# Altium schematic sheet VOEDING.SchDoc
size A3; SheetNumber: 5; SheetTotal: 7
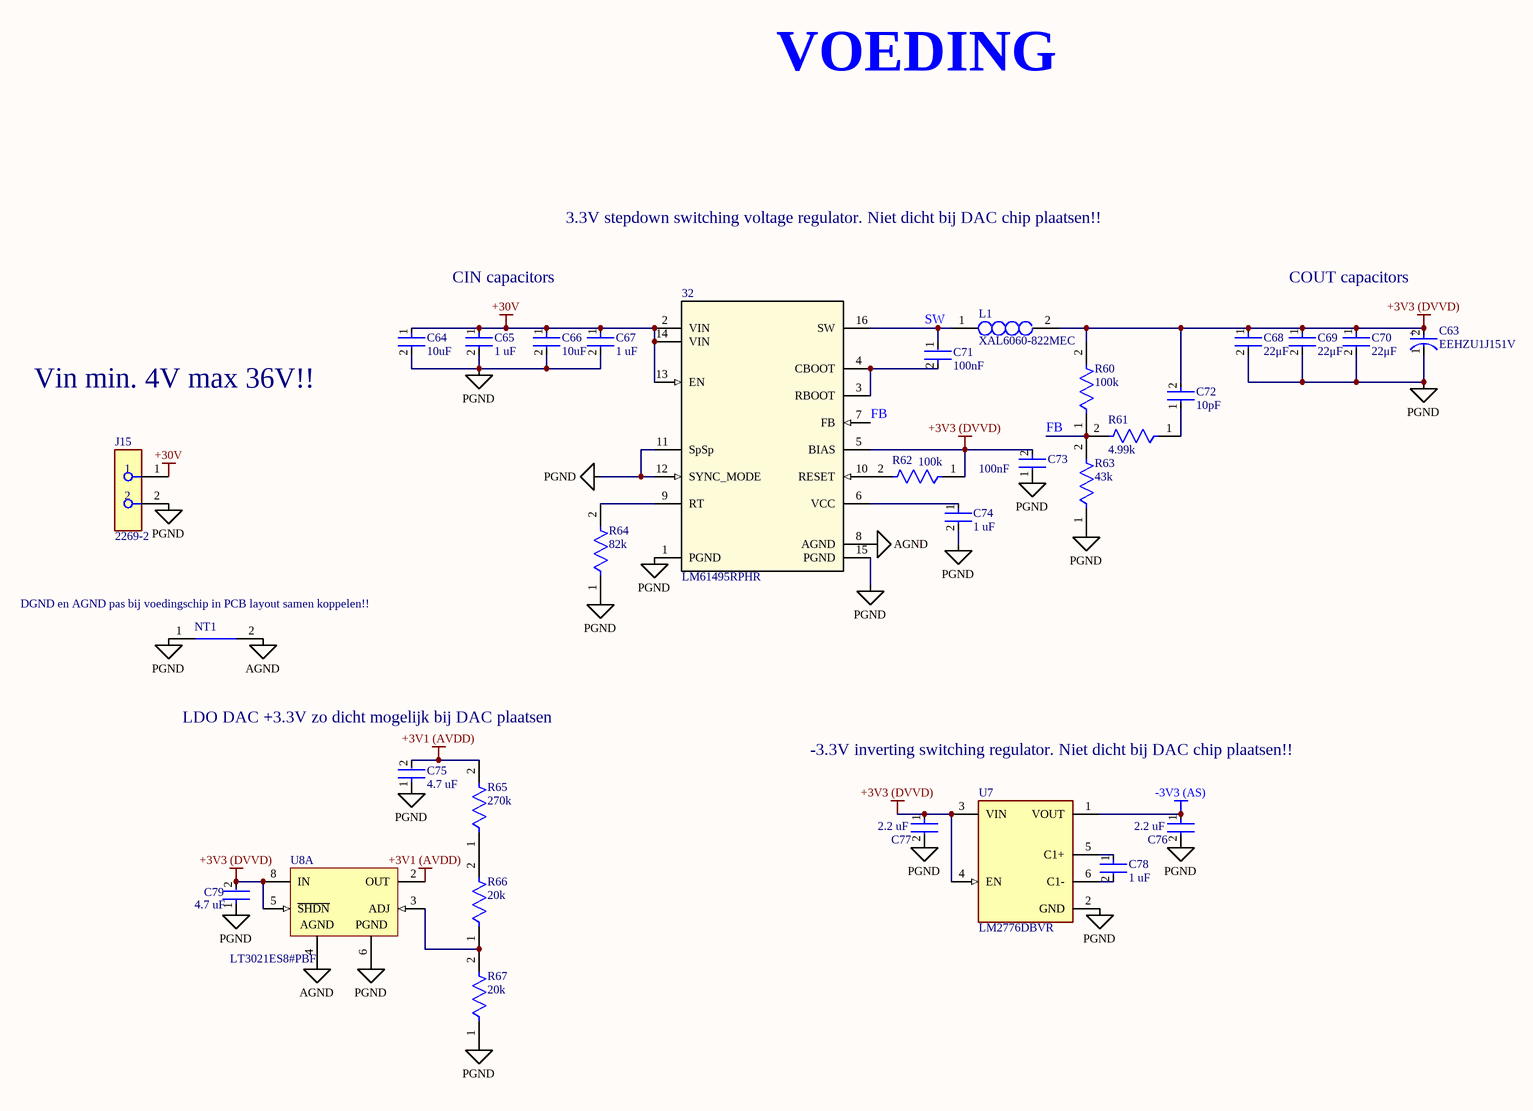
[diagram p0: VOEDING.SchDoc]

## Parts
32  LM61495RPHR  [RPH0016A]
C63  EEHZU1J151V  [FP-EEH-G16-V-MFG]
C64  10uF  [FP-GRM32-MFG]
C65  1 uF  [FP-C0603C-CF-MFG]
C66  10uF  [FP-GRM32-MFG]
C67  1 uF  [FP-C0603C-CF-MFG]
C68  22μF  [FP-C2012-125-0_2-MFG]
C69  22μF  [FP-C2012-125-0_2-MFG]
C70  22μF  [FP-C2012-125-0_2-MFG]
C71  100nF  [FP-GRM15-MFG]
C72  10pF  [FP-GRM15-MFG]
C73  100nF  [FP-GRM15-MFG]
C74  1 uF  [FP-C0603C-CF-MFG]
C75  4.7 uF  [FP-C0603C-CF-MFG]
C76  2.2 uF  [FP-C0603C-CF-MFG]
C77  2.2 uF  [FP-C0603C-CF-MFG]
C78  1 uF  [FP-C0603C-CF-MFG]
C79  4.7 uF  [FP-C0603C-CF-MFG]
J15  2269-2  [FP-2269-2-MFG]
L1  XAL6060-822MEC  [XAL6060822MEC]
NT1  NT (AGND en PGND)  [NET_TIE_SMD_]  (value not drawn)  (net tie, no BOM)
R60  100k  [FP-CRCW0402-C-e3-MFG]
R61  4.99k  [FP-CRCW0402-e3-MFG]
R62  100k  [FP-CRCW0402-C-e3-MFG]
R63  43k  [FP-CRCW0402-C-e3-MFG]
R64  82k  [FP-CRCW0402-C-e3-MFG]
R65  270k  [FP-CRCW0402-C-e3-MFG]
R66  20k  [FP-CRCW0402-C-e3-MFG]
R67  20k  [FP-CRCW0402-C-e3-MFG]
U7  LM2776DBVR  [FP-DBV0006A-MFG]
U8  LT3021ES8#PBF  [LT-S8-8_L]  (part A of 2)

## Nets
+3V1 (AVDD): C75.2 R65.2 U8.2(OUT)
+3V3 (DVVD): 32.5(BIAS) C63.2(A) C68.1 C69.1 C70.1 C72.2 C73.2 C77.1 C79.2 L1.2 R60.2 R62.1 U7.3(VIN) U7.4(EN) U8.5(~{SHDN}) U8.8(IN)
+30V: 32.2(VIN) 32.13(EN) 32.14(VIN) C64.1 C65.1 C66.1 C67.1 J15.1
-3V3 (AS): C76.1 U7.1(VOUT)
AGND: 32.8(AGND) NT1.2 U8.4(AGND)
PGND: 32.1(PGND) 32.11(SpSp) 32.12(SYNC_MODE) 32.15(PGND) C63.1(C) C64.2 C65.2 C66.2 C67.2 C68.2 C69.2 C70.2 C73.1 C74.2 C75.1 C76.2 C77.2 C79.1 J15.2 NT1.1 R63.1 R64.1 R67.1 U7.2(GND) U8.6(PGND)
FB: 32.7(FB) R60.1 R61.2 R63.2
SW: 32.16(SW) C71.1 L1.1
Net32_3: 32.3(RBOOT) 32.4(CBOOT) C71.2
Net32_6: 32.6(VCC) C74.1
Net32_9: 32.9(RT) R64.2
Net32_10: 32.10(RESET) R62.2
NetC72_1: C72.1 R61.1
NetC78_1: C78.1 U7.5(C1+)
NetC78_2: C78.2 U7.6(C1-)
NetR65_1: R65.1 R66.2
NetR66_1: R66.1 R67.2 U8.3(ADJ)

## Notes on the sheet
- VOEDING
- 3.3V stepdown switching voltage regulator. Niet dicht bij DAC chip plaatsen!!
- CIN capacitors
- COUT capacitors
- Vin min. 4V max 36V!!
- (near NT1) DGND en AGND pas bij voedingschip in PCB layout samen koppelen!!
- LDO DAC +3.3V zo dicht mogelijk bij DAC plaatsen
- -3.3V inverting switching regulator. Niet dicht bij DAC chip plaatsen!!
- (in symbol CMP-05428-001018-1) +

## Library data of the parts
32 = LM61495RPHR: No Description Available; Mfr_Name: Texas Instruments; TYPE: TYPE; RefDes: RefDes
C63 = CMP-05428-001018-1: Aluminum Hybrid Polymer Capacitors 150uF 20% 63V Life 4000Hours AEC-Q200 RADIAL SMT; RoHS Compliant: Yes
C64 C66 = CMP-2000-05261-2: CAP CER 10UF 50V X7R 1210; Manufacturer Part Number: GRM32ER71H106KA12L; Manufacturer: Murata; Tolerance: 10%; Material: Ceramic; Temperature Coefficient: 15%; Voltage Rating: 50V; Temperature Characteristic: X7R; Value: 10uF; ComponentLink2Description: Datasheet; Device Class L1: Passive Components; Lead Free: Yes; Temperature Range High: +125°C; Category: Cap; ComponentLink2URL: https://search.murata.co.jp/Ceramy/image/img/A01X/G101/ENG/GRM32ER71H106KA12-01.pdf; Device Class L2: Capacitors; Package: GRM32; Mouser Description: 1210 10 uF 50 V ±10% Tolerance X7R SMT Multilayer Ceramic Capacitor; Capacitance: 10uF; Octopart: https://octopart.com/grm32er71h106ka12l-murata-10470987; Digikey Description: CAP CER 10UF 50V X7R 1210; Height: 2.7mm; Temperature: -55°C to +125°C; Temperature Range Low: -55°C; RoHS: TRUE; Device Class L3: Ceramic Capacitors; Automotive: No
C65 C67 C74 C78 = CMP-2006-03056-2: CAP CER 1 UF 50V 5% X7R 0603; Manufacturer Part Number: C0603C104J5RACTU; Manufacturer: KEMET; Generic part Eurocircuits:: GPC0603105; Automotive Grade: Grade 1; Tolerance: 0.05; Capacitance: 1 μF; Value: 1 μF; Material: Ceramic; Temperature Coefficient: 30ppm/°C; ComponentLink2Description: Datasheet; Voltage Rating: 50 V; Digikey Description: CAP CER 0.1UF 50V 5% X7R 0603; Temperature Range High: +125°C; Device Class L2: Capacitors; Octopart: https://octopart.com/c0603c104j5ractu-kemet-10440638; RoHS: TRUE; Mouser Description: Multilayer Ceramic Capacitors MLCC - SMD/SMT 50volts 0.1uF X7R 5%; Temperature Range Low: -55°C; Automotive: Yes; Lead Free: Yes; ComponentLink2URL: https://api.kemet.com/component-edge/download/datasheet/C0603C100J5GACAUTO.pdf; Device Class L3: Ceramic Capacitors; Package: C0603C-CF; Category: Cap; Temperature: -55°C to +125°C; Height: 0.87mm; Temperature Characteristic: X7R; Device Class L1: Passive Components
C68-C70 = CMP-08246-005813-1: Multilayer Ceramic Capacitors 22μF ±20% 10V X5R SMD 0805; Capacitance: 22uF; Termination: SMD/SMT; Width: 0.049inch; Dielectric: X5R; Tolerance: 20%; Resistor Type: Ceramic; Construction: Flat; Package Quantity: 1; Mount: Surface Mount; Packaging: Tape and Reel; Case Code (Imperial): 0805; Dielectric Material: Ceramic; Case/Package: 0805; Series: C; Voltage Rating (DC): 10V; Min Operating Temperature: -55°C; Lead Free: Lead Free; Weight: 0.000194oz; Thickness: 0.057inch; RoHS Compliant: Yes; REACH SVHC: No SVHC; Depth: 1.25mm; Max Operating Temperature: 85°C; Length: 2mm; Number of Pins: 2; Case Code (Metric): 2012; Voltage Rating: 10V; Height: 1.25mm
C71 C73 = CMP-2100-03641-2: CAP CER 0.1UF 16V X7R 0402; Manufacturer Part Number: GRM155R71C104KA88D; Manufacturer: Murata; Standoff Height: 0mm; Tolerance: 10%; Voltage Rating: 16Vdc; Material: Ceramic; Capacitance: 0.10μF; Value: 0.10μF; RoHS: TRUE; Temperature Characteristic: X7R; Octopart: https://octopart.com/grm155r71c104ka88d-murata-196880; Digikey Description: CAP CER 0.1UF 16V X7R 0402; Device Class L3: Ceramic Capacitors; Height: 0.55mm; ComponentLink2Description: Datasheet; Temperature Range Low: -55°C; Ipc Land Pattern Name: CAPC10050X219; ComponentLink2URL: https://search.murata.co.jp/Ceramy/image/img/A01X/G101/ENG/GRM155R71H471KA01-01A.pdf; Device Class L1: Passive Components; Lead Free: yes; Category: Cap; Package: GRM15; Temperature: -55°C to +125°C; Device Class L2: Capacitors; Temperature Range High: +125°C; Mouser Description: 0402 0.1 uF 16V ±10 % Tolerance X7R SMT Multilayer Ceramic Capacitor
C72 = CMP-2100-03641-2: CAP CER 10pF 16V X7R 0402; Manufacturer Part Number: GRM155R71C104KA88D; Manufacturer: Murata; Standoff Height: 0mm; Tolerance: 10%; Voltage Rating: 16Vdc; Material: Ceramic; RoHS: TRUE; Temperature Characteristic: X7R; Octopart: https://octopart.com/grm155r71c104ka88d-murata-196880; Digikey Description: CAP CER 0.1UF 16V X7R 0402; Device Class L3: Ceramic Capacitors; Height: 0.55mm; ComponentLink2Description: Datasheet; Temperature Range Low: -55°C; Ipc Land Pattern Name: CAPC10050X219; ComponentLink2URL: https://search.murata.co.jp/Ceramy/image/img/A01X/G101/ENG/GRM155R71H471KA01-01A.pdf; Device Class L1: Passive Components; Lead Free: yes; Category: Cap; Package: GRM15; Temperature: -55°C to +125°C; Device Class L2: Capacitors; Capacitance: 10pF; Value: 10pF; Temperature Range High: +125°C; Mouser Description: 0402 0.1 uF 16V ±10 % Tolerance X7R SMT Multilayer Ceramic Capacitor
C75 C79 = CMP-2006-03056-2: CAP CER 4.7 UF 50V 5% X7R 0603; Manufacturer Part Number: C0603C104J5RACTU; Manufacturer: KEMET; Generic part Eurocircuits:: GPC0603475-10; Automotive Grade: Grade 1; Tolerance: 0.05; Capacitance: 4.7 μF; Value: 4.7 μF; Material: Ceramic; Temperature Coefficient: 30ppm/°C; ComponentLink2Description: Datasheet; Voltage Rating: 50 V; Digikey Description: CAP CER 0.1UF 50V 5% X7R 0603; Temperature Range High: +125°C; Device Class L2: Capacitors; Octopart: https://octopart.com/c0603c104j5ractu-kemet-10440638; RoHS: TRUE; Mouser Description: Multilayer Ceramic Capacitors MLCC - SMD/SMT 50volts 0.1uF X7R 5%; Temperature Range Low: -55°C; Automotive: Yes; Lead Free: Yes; ComponentLink2URL: https://api.kemet.com/component-edge/download/datasheet/C0603C100J5GACAUTO.pdf; Device Class L3: Ceramic Capacitors; Package: C0603C-CF; Category: Cap; Temperature: -55°C to +125°C; Height: 0.87mm; Temperature Characteristic: X7R; Device Class L1: Passive Components
C76 C77 = CMP-2006-03056-2: CAP CER 2.2 UF 50V 5% X7R 0603; Manufacturer Part Number: C0603C104J5RACTU; Manufacturer: KEMET; Generic part Eurocircuits:: GPC0603105; Automotive Grade: Grade 1; Tolerance: 0.05; Capacitance: 2.2 μF; Value: 2.2 μF; Material: Ceramic; Temperature Coefficient: 30ppm/°C; ComponentLink2Description: Datasheet; Voltage Rating: 50 V; Digikey Description: CAP CER 0.1UF 50V 5% X7R 0603; Temperature Range High: +125°C; Device Class L2: Capacitors; Octopart: https://octopart.com/c0603c104j5ractu-kemet-10440638; RoHS: TRUE; Mouser Description: Multilayer Ceramic Capacitors MLCC - SMD/SMT 50volts 0.1uF X7R 5%; Temperature Range Low: -55°C; Automotive: Yes; Lead Free: Yes; ComponentLink2URL: https://api.kemet.com/component-edge/download/datasheet/C0603C100J5GACAUTO.pdf; Device Class L3: Ceramic Capacitors; Package: C0603C-CF; Category: Cap; Temperature: -55°C to +125°C; Height: 0.87mm; Temperature Characteristic: X7R; Device Class L1: Passive Components
J15 = CMP-73906-000010-1: CONN DBL BANANA JACK TURRET; Voltage Rating (DC): 70V; Max Current Rating: 15A; Number of Contacts: 2; Voltage Rating: 2.5kV; Body Material: PC; Gender: Female; Insulation: Mating End Insulated; Housing Color: Red; Insulation Material: Polycarbonate; Contact Material: Brass; Termination: Solder; Height: 0.375inch; Orientation: Straight; Lead Free: Lead Free; Length: 24inch; Depth: 16mm; Current Rating: 15A; Width: 4inch; Contact Plating: Tin; Weight: 0.033lb; RoHS Compliant: Yes; REACH SVHC: No SVHC; Package Quantity: 5; Number of Ports: 2; Color: Red; Housing Material: Polycarbonate; Packaging: Bulk; Mount: Panel
L1 = XAL6060-822MEC: 8.2 uH Inductor; Manufacturer_Name: COILCRAFT; Datasheet Link: https://www.coilcraft.com/getmedia/ea51f14b-7f32-4dc6-8dfe-d4b70549040f/xal60xx.pdf; Height: 6.1mm; Manufacturer_Part_Number: XAL6060-822MEC; Mouser Part Number: 994-XAL6060-822MEC; Mouser Price/Stock: https://www.mouser.co.uk/ProductDetail/Coilcraft/XAL6060-822MEC?qs=zCSbvcPd3pZnGF7hddsKzw%3D%3D
NT1 = NET_TIE_SMD: NET TIE SMD
R60 R62 R64 = CMP-02407-010951-1: RES 100K OHM 1% 1/16W 0402; Temperature Coefficient: 100ppm/°C; Power Rating: 62.5mW; Resistance: 100kR; Lead Free: Lead Free; Length: 1mm; Tolerance: 1%; Resistor Type: Thick Film; Contact Plating: Tin; Case/Package: SMD/SMT; Min Operating Temperature: -55°C; RoHS Compliant: Yes; Termination: Wraparound; Max Operating Temperature: 155°C; Mount: Surface Mount
R61 = CMP-2002-00057-2: RES Thick Film, 4.99kΩ, 1%, 0.063W, 100ppm/°C, 0402; Power Rating: 63mW; Resistance: 4.99kR; Voltage Rating: 50V; Package Quantity: 10; Max Power Dissipation: 63mW; Temperature Coefficient: 100ppm/°C; Lead Free: Lead Free; Mount: Surface Mount; Height: 0.35mm; Number of Terminations: 2; Contact Plating: Tin; Case/Package: 0402; Max Operating Temperature: 155°C; Case Code (Imperial): 0402; Weight: 2.3E-05oz; Width: 0.5mm; Features: Automotive AEC-Q200; Voltage Rating (DC): 50V; Tolerance: 1%; Min Operating Temperature: -55°C; Length: 1mm; Depth: 0.5mm; Military Standard: Not; Packaging: Tape and Reel; Radiation Hardening: No; Composition: Thick Film; Termination: SMD/SMT; Case Code (Metric): 1005
R63 = CMP-02407-010951-1: RES 43k OHM 1% 1/16W 0402; Temperature Coefficient: 100ppm/°C; Power Rating: 62.5mW; Lead Free: Lead Free; Length: 1mm; Tolerance: 1%; Resistor Type: Thick Film; Contact Plating: Tin; Case/Package: SMD/SMT; Min Operating Temperature: -55°C; RoHS Compliant: Yes; Termination: Wraparound; Max Operating Temperature: 155°C; Mount: Surface Mount; Resistance: 43k
R65 = CMP-02407-010951-1: RES 270K OHM 1% 1/16W 0402; Temperature Coefficient: 100ppm/°C; Power Rating: 62.5mW; Resistance: 270kR; Lead Free: Lead Free; Length: 1mm; Tolerance: 1%; Resistor Type: Thick Film; Contact Plating: Tin; Case/Package: SMD/SMT; Min Operating Temperature: -55°C; RoHS Compliant: Yes; Termination: Wraparound; Max Operating Temperature: 155°C; Mount: Surface Mount
R66 R67 = CMP-02407-010951-1: RES 20K OHM 1% 1/16W 0402; Temperature Coefficient: 100ppm/°C; Power Rating: 62.5mW; Resistance: 20kR; Lead Free: Lead Free; Length: 1mm; Tolerance: 1%; Resistor Type: Thick Film; Contact Plating: Tin; Case/Package: SMD/SMT; Min Operating Temperature: -55°C; RoHS Compliant: Yes; Termination: Wraparound; Max Operating Temperature: 155°C; Mount: Surface Mount
U7 = CMP-04918-000109-1: IC REG CHARGE PUMP INV SOT23; Manufacturer: Texas Instruments; Nominal Supply Current: 100uA; Switching Frequency: 2MHz; Number Of Outputs: 1; Standoff Height: 0mm; Min Supply Voltage: 2.7V; Output Current: 200mA; Max Supply Voltage: 5.5V; Output Type: Fixed; Max Junction Temp: +125°C; Negative Voltage Available: true; Output Voltage: -2.7-5.5V; Device Class L2: Power Management ICs; Temperature: -40°C to +85°C; Digikey Description: IC REG CHARGE PUMP INV SOT23; Octopart: https://octopart.com/lm2776dbvr-texas+instruments-58839919; Package: DBV0006A; ComponentLink2Description: Datasheet; Manufacturer Part Number: LM2776DBVR; Ambient Temperature Range Low: -40°C; RoHS: TRUE; Temperature Range Low: -40°C; Lead Free: Yes; Automotive: No; Ambient Temperature Range High: +85°C; Device Class L1: Integrated Circuits (ICs); Category: IC; Device Class L3: Voltage Regulators - Switching; Switching Topology: Charge Pump; Height: 1.45mm; ComponentLink2URL: http://www.ti.com/lit/ds/symlink/lm2776.pdf; Temperature Range High: +85°C
U8 = CMP-0476-01501-1: Low 160 mV Dropout Voltage, Internal PNP Pass Element, 200 mV Reference Voltage, 0.9 to 10 V Vin, Adjustable Vout, 8-pin SOIC (S8-8), -40 to 125 degC, Pb-Free; Manufacturer: Linear Technology; Vin Min(V): 0.9; Noise(uV): 300; Isupply(mA): 0.12; Number of Outputs: 1; Output Voltage: Adj; Vout Min(V): 0.2; PSRR(dB): 70; Discrete Pass Element: no; Iout(mA): 500; Vin Max(V): 10; Dropout Voltage(V): 0.155; Vout Max(V): 9.8; Shutdown Current(uA): 3; ComponentLink1Description: Manufacturer URL; ComponentLink3Description: Package Specification; ComponentLink3URL: http://cds.linear.com/docs/en/packaging/05081610_G_SO8.pdf; Mounting Technology: Surface Mount; DatasheetVersion: Rev. C; PackageVersion: Rev. G, 03/2012; ComponentLink2Description: Datasheet; ComponentLink1URL: http://www.linear.com/; PackageReference: S8-8; PartNumber: LT3021ES8#PBF; RoHS: TRUE; PackageDescription: 8-Pin Plastic Small Outline (Narrow .150 Inch), Body 4.9 x 3.9 mm, Pitch 1.27 mm; ComponentLink2URL: http://cds.linear.com/docs/en/datasheet/3021fc.pdf